# EAGLE design Snake (EAGLE 7.7.0)
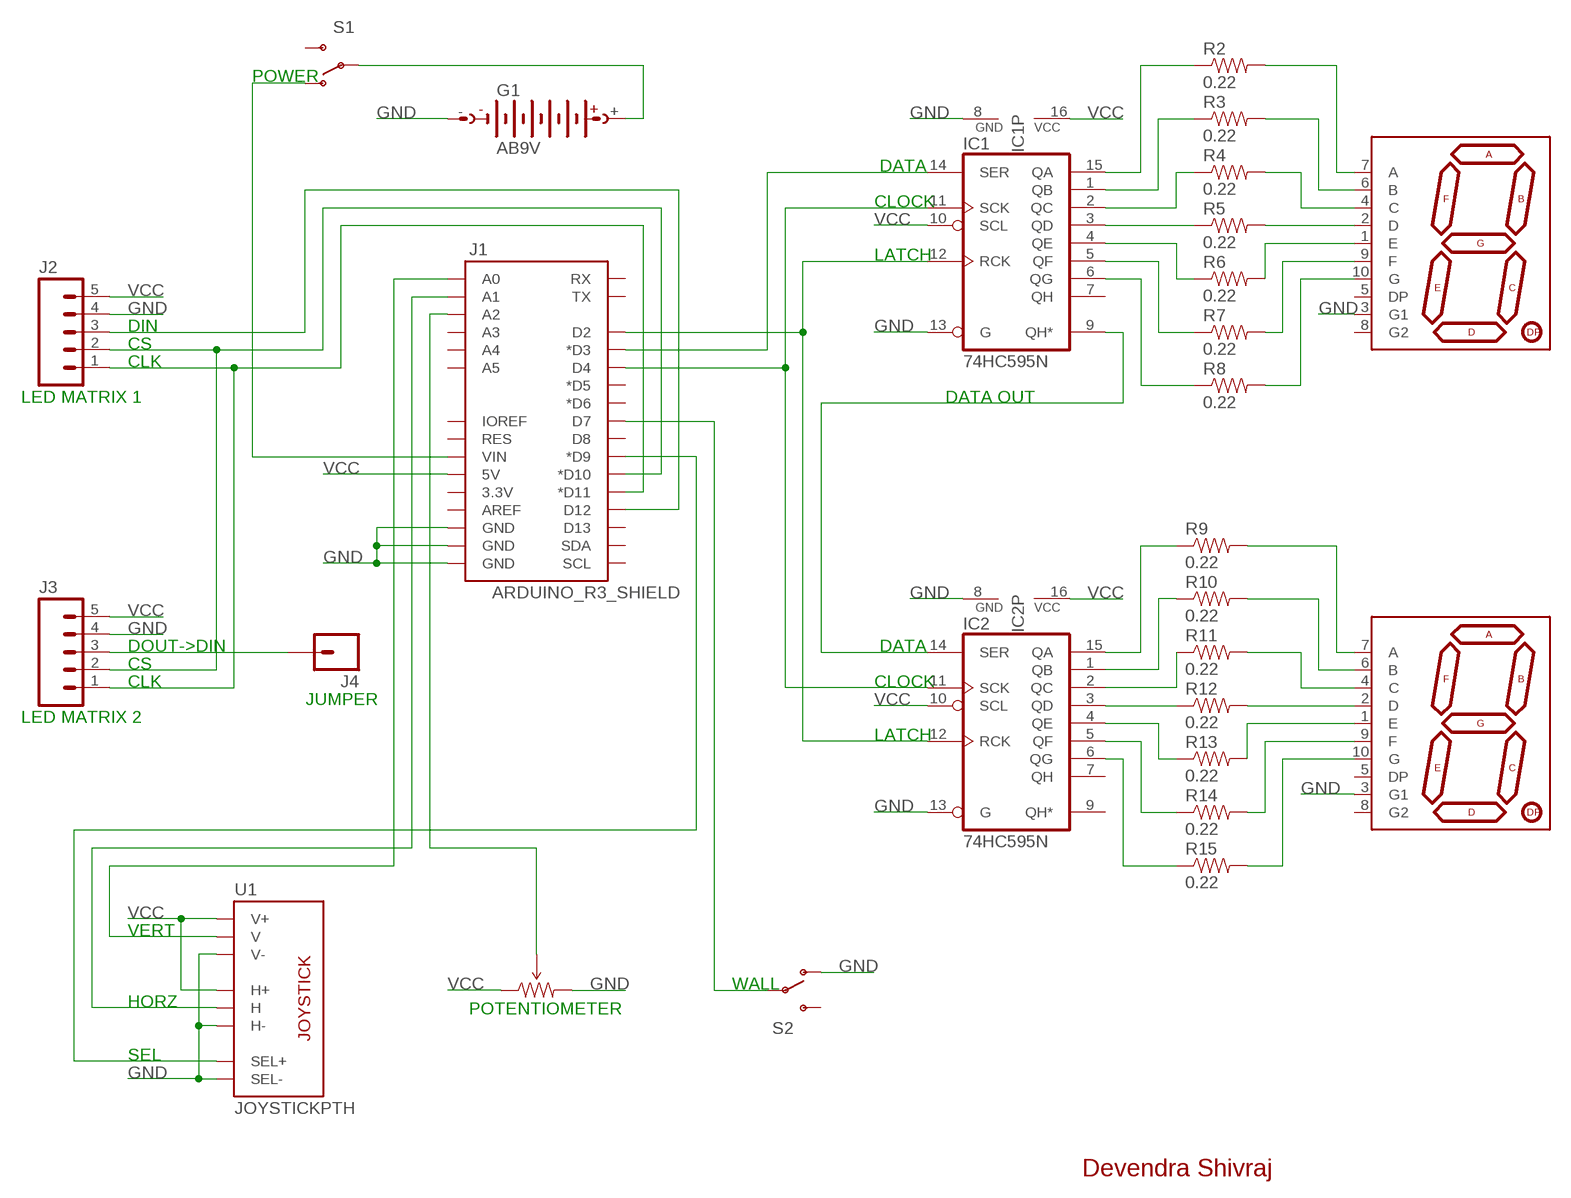
[diagram p0: schematic, sheet 1]

## Parts
G1  AB9V  [AB9V]
IC1  74HC595N  [DIL16]
IC2  74HC595N  [DIL16]
J1  ARDUINO_R3_SHIELD  [UNO_R3_SHIELD]
J2  M05PTH  [1X05]
J3  M05PTH  [1X05]
J4  M01PTH  [1X01]
R1  TSR-3386  TRIMPOT-PTH-KNOB  [3386U]
R2  0.22  0.22OHM-1/4W-1%(0805)  [0805]
R3  0.22  0.22OHM-1/4W-1%(0805)  [0805]
R4  0.22  0.22OHM-1/4W-1%(0805)  [0805]
R5  0.22  0.22OHM-1/4W-1%(0805)  [0805]
R6  0.22  0.22OHM-1/4W-1%(0805)  [0805]
R7  0.22  0.22OHM-1/4W-1%(0805)  [0805]
R8  0.22  0.22OHM-1/4W-1%(0805)  [0805]
R9  0.22  0.22OHM-1/4W-1%(0805)  [0805]
R10  0.22  0.22OHM-1/4W-1%(0805)  [0805]
R11  0.22  0.22OHM-1/4W-1%(0805)  [0805]
R12  0.22  0.22OHM-1/4W-1%(0805)  [0805]
R13  0.22  0.22OHM-1/4W-1%(0805)  [0805]
R14  0.22  0.22OHM-1/4W-1%(0805)  [0805]
R15  0.22  0.22OHM-1/4W-1%(0805)  [0805]
S1  SWITCH-SPDTPTH  [SWITCH-SPDT]
S2  SWITCH-SPDTPTH  [SWITCH-SPDT]
U1  JOYSTICKPTH  [JOYSTICK]
U$1  7-SEGMENT-DISPLAYPTH  [7-SEGMENT-DISPLAY]
U$2  7-SEGMENT-DISPLAYPTH  [7-SEGMENT-DISPLAY]

## Nets
+: G1.+ S1.2(P)
A2: J1.A2 R1.2(WIPER)
CLK: J1.D11(*D11) J2.1 J3.1
CLOCK: IC1.11(SCK) IC2.11(SCK) J1.D4
CS: J1.D10(*D10) J2.2 J3.2
DATA: IC1.14(SER) J1.D3(*D3)
DATA_SHIFT: IC1.9(QH*) IC2.14(SER)
DIN: J1.D12 J2.3
GND: G1.- IC1.8(GND) IC1.13(G) IC2.8(GND) IC2.13(G) J1.GND@0(GND) J1.GND@1(GND) J1.GND@2(GND) J2.4 J3.4 R1.3(CW) S2.1(O) U1.B2A(SEL-) U1.H3(H-) U1.V3(V-) U$1.3(G1) U$2.3(G1)
HORZ: J1.A1 U1.H2(H)
LATCH: IC1.12(RCK) IC2.12(RCK) J1.D2
N$1: J3.3 J4.1
N$3: J1.VIN S1.1(O)
N$4: IC1.15(QA) R2.1
N$5: IC1.1(QB) R3.1
N$6: IC1.2(QC) R4.1
N$7: IC1.3(QD) R5.1
N$8: IC1.4(QE) R6.1
N$9: IC1.5(QF) R7.1
N$10: IC1.6(QG) R8.1
N$15: R2.2 U$1.7(A)
N$16: R3.2 U$1.6(B)
N$17: R4.2 U$1.4(C)
N$18: R5.2 U$1.2(D)
N$19: R6.2 U$1.1(E)
N$20: R7.2 U$1.9(F)
N$21: R8.2 U$1.10(G)
N$22: IC2.15(QA) R9.1
N$23: J1.D7 S2.2(P)
N$27: IC2.1(QB) R10.1
N$28: IC2.2(QC) R11.1
N$30: IC2.3(QD) R12.1
N$31: IC2.4(QE) R13.1
N$32: IC2.5(QF) R14.1
N$33: IC2.6(QG) R15.1
N$34: R9.2 U$2.7(A)
N$35: R10.2 U$2.6(B)
N$36: R11.2 U$2.4(C)
N$37: R12.2 U$2.2(D)
N$38: R13.2 U$2.1(E)
N$39: R14.2 U$2.9(F)
N$40: R15.2 U$2.10(G)
SEL: J1.D9(*D9) U1.B1A(SEL+)
VCC: IC1.10(SCL) IC1.16(VCC) IC2.10(SCL) IC2.16(VCC) J1.5V J2.5 J3.5 R1.1(CCW) U1.H1(H+) U1.V1(V+)
VERT: J1.A0 U1.V2(V)
Unconnected: IC1.7(QH) IC2.7(QH) IC2.9(QH*) J1.3.3V J1.A3 J1.A4 J1.A5 J1.AREF J1.D5(*D5) J1.D6(*D6) J1.D8 J1.D13 J1.IOREF J1.RES J1.RX J1.SCL J1.SDA J1.TX S1.3(S) S2.3(S) U$1.5(DP) U$1.8(G2) U$2.5(DP) U$2.8(G2)

## Notes on the sheet
- POWER
- DATA
- CLOCK
- LATCH
- DIN
- CS
- CLK
- LED MATRIX 1 | DATA OUT
- DOUT->DIN | DATA
- CS
- CLK | CLOCK
- JUMPER
- LED MATRIX 2
- LATCH
- VERT
- WALL
- HORZ
- POTENTIOMETER
- SEL
- Devendra Shivraj

## Library data of the parts
G1 = battery:AB9V: 9-V BATTERY CLIP
IC1 IC2 = 74xx-eu:74*595: 8-bit SHIFT REGISTER, output latch
J1 = SparkFun-Boards:ARDUINO_R3_SHIELD: Shield form compatible with the Arduino Uno R3.
J2 J3 = SparkFun-Connectors:M05: Header 5 Standard 5-pin 0.1" header. Use with straight break away headers (SKU : PRT-00116), right angle break away headers (PRT-00553), swiss pins (PRT-00743), machine pins (PRT-00117), and female headers (PRT-00115). Molex polarized connector foot print use with SKU : PRT-08230 with associated crimp pins and housings.
J4 = SparkFun-Connectors:M01: Header 1 Standard 1-pin 0.1" header. Use with straight break away headers (SKU : PRT-00116), right angle break away headers (PRT-00553), swiss pins (PRT-00743), machine pins (PRT-00117), and female headers (PRT-00115). SMTSO-256-ET is a "flush mount" nut for a 4-40 screw. The older package used to be too tight, and did not allow it to sit properly thru the drill hit. The latest (0.165DIA) fits nice and snug.
R1 = SparkFun-Electromechanical:TRIMPOT: Various small potentiometers for "set-and-forget" applications; PROD_ID: RES-09730
R2-R15 = SparkFun-Resistors:0.22OHM-1/4W-1%(0805): RES-09883; PROD_ID: RES-09883
S1 S2 = SparkFun-Electromechanical:SWITCH-SPDT: SPDT Switch Simple slide switch, Spark Fun Electronics SKU : COM-00102 DPDT SMT slide switch, AYZ0202, SWCH-08179; PROD_ID: SWCH-08261
U1 = SparkFun:JOYSTICK: Thumb Joystick Joystick commonly found in PS2 controllers. Two pots and a select switch. Footprint proven. Spark Fun Electronics SKU : COM-09032
U$1 U$2 = SparkFun-Displays:7-SEGMENT-DISPLAY

## Board
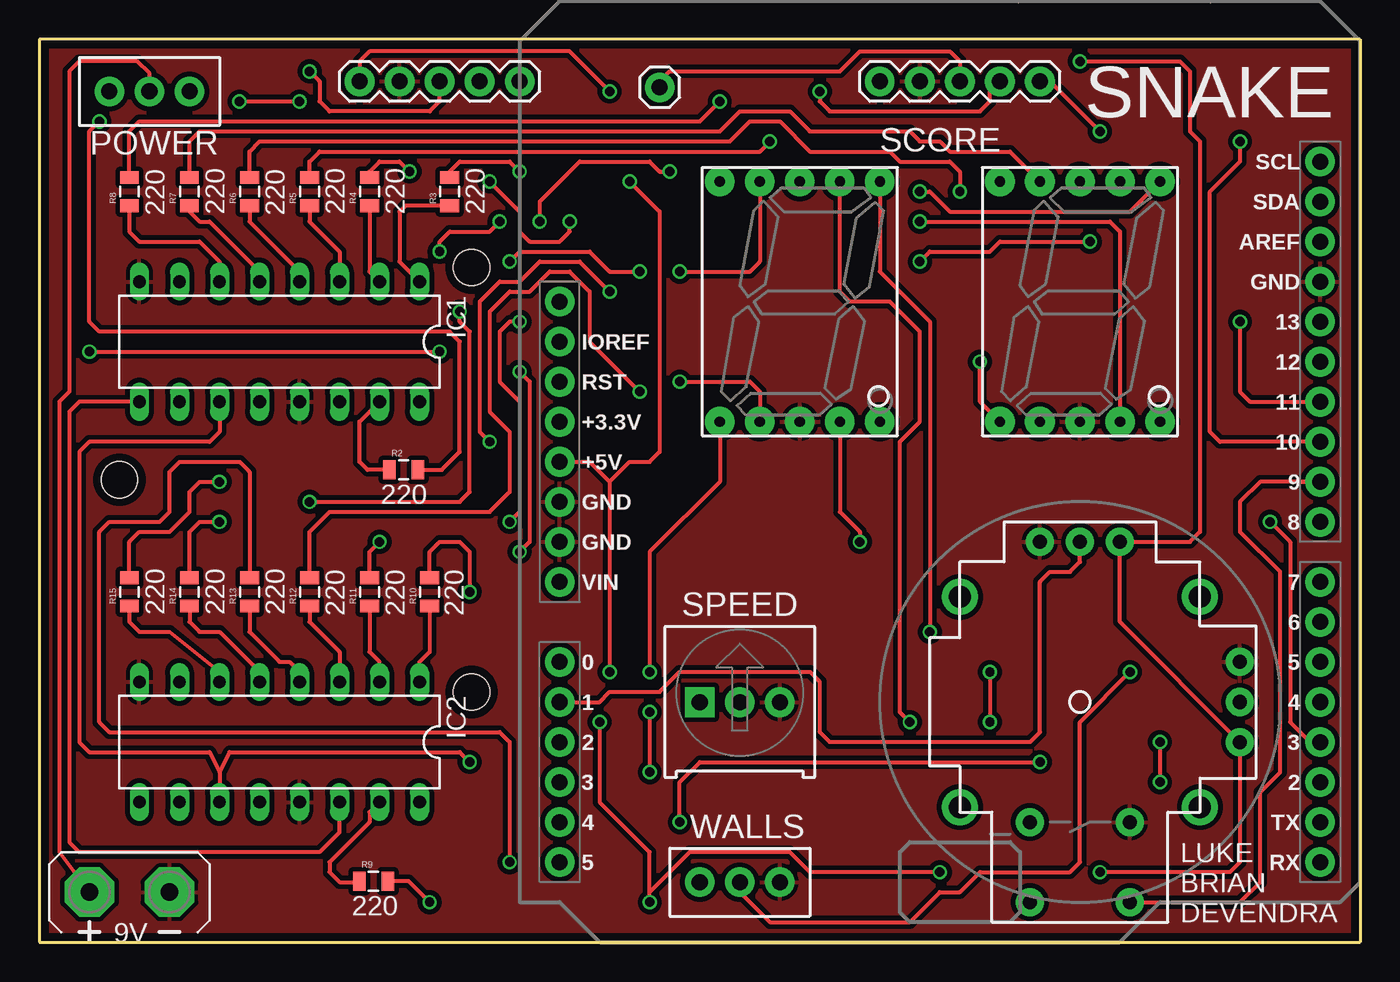
[diagram p1: board, top side]
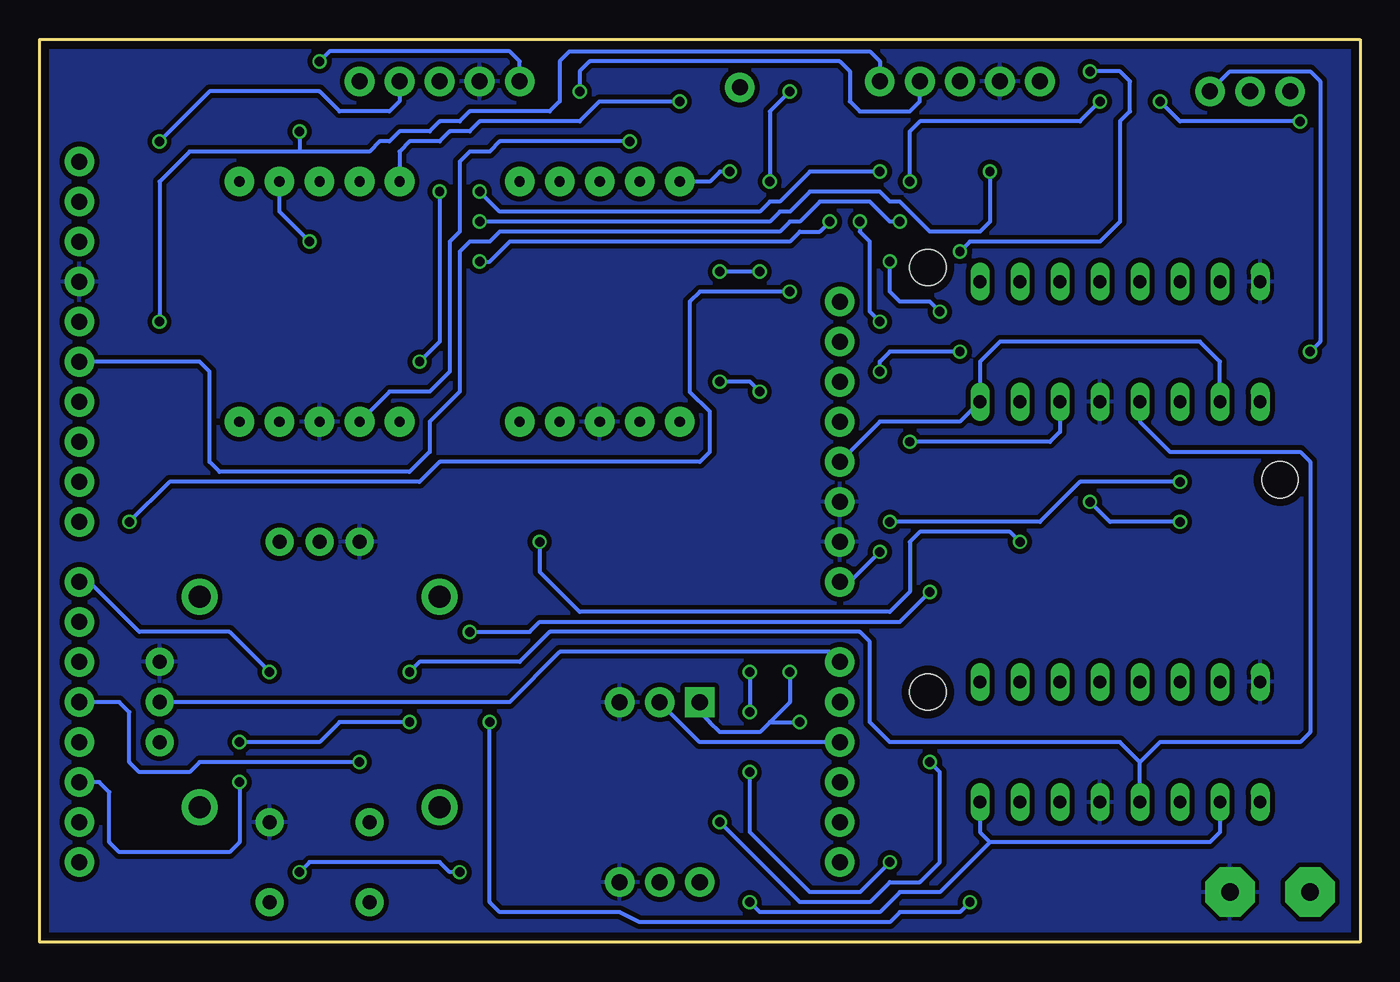
[diagram p2: board, bottom side, seen from below]

Size 83.82 x 57.28 mm. Coordinates in mm from the lower left corner, seen from the top.
Outline: 0,0 83.82,0 83.82,57.28 0,57.28 0,0
Copper layers (1*16): Top 0.035mm / dielectric 1.6mm / Bottom 0.035mm
Design rules "Elecrow_2-layer_PCB_eagle_rule": minimum track width 6mil, minimum drill 12mil, track to track 6mil, track to pad 6mil, pad to pad 6mil, via to via 8mil, smd to smd 0mil, copper to edge 20mil, drill to drill 10mil, minimum pad ring 6mil, minimum via ring 6mil, stop-mask expansion 0mil, vias tented up to drill 100mil, thermal gap 10mil
Holes 2.29 mm at 5.08,29.34 27.43,42.8 27.43,15.88

### Footprints (pad centres in the part's own frame; a part is rotated, then mirrored left to right if it is on the bottom)
AB9V = drill 1.118 pad 3.15 octagon: + 0,2.54; - 0,-2.54
DIL16 = drill 0.813 long: 1 -8.89,-3.81; 2 -6.35,-3.81; 3 -3.81,-3.81; 4 -1.27,-3.81; 5 1.27,-3.81; 6 3.81,-3.81; 7 6.35,-3.81; 8 8.89,-3.81; 9 8.89,3.81; 10 6.35,3.81; 11 3.81,3.81; 12 1.27,3.81; 13 -1.27,3.81; 14 -3.81,3.81; 15 -6.35,3.81; 16 -8.89,3.81
UNO_R3_SHIELD = drill 1.016 pad 1.88: 3.3V 50.8,26.67; 5V 50.8,29.21; A0 50.8,41.91; A1 50.8,44.45; A2 50.8,46.99; A3 50.8,49.53; A4 50.8,52.07; A5 50.8,54.61; AREF 2.54,15.24; D2 2.54,49.53; D3 2.54,46.99; D4 2.54,44.45; D5 2.54,41.91; D6 2.54,39.37; D7 2.54,36.83; D8 2.54,33.02; D9 2.54,30.48; D10 2.54,27.94; D11 2.54,25.4; D12 2.54,22.86; D13 2.54,20.32; GND@0 50.8,31.75; GND@1 50.8,34.29; GND@2 2.54,17.78; IOREF 50.8,21.59; NC 50.8,19.05; RES 50.8,24.13; RX 2.54,54.61; SCL 2.54,10.16; SDA 2.54,12.7; TX 2.54,52.07; VIN 50.8,36.83
1X05 = drill 1.016 pad 1.88: 1 0,0; 2 2.54,0; 3 5.08,0; 4 7.62,0; 5 10.16,0
1X01 = drill 1.016 pad 1.88: 1 0,0
3386U = drill 1.016 pad 1.88 square: 1 -2.54,-0.015 | drill 1.016 pad 1.88: 2 0,-0.015; 3 2.54,-0.015
0805 = smd 0.8 x 1.2: 1 -0.9,0; 2 0.9,0
SWITCH-SPDT = drill 1.016 pad 1.88: 1 0,2.54; 2 0,0; 3 0,-2.54
JOYSTICK = drill 0.9 pad 1.778: B1A -3.175,12.7; B1B 3.175,12.7; B2A -3.175,7.62; B2B 3.175,7.62 | drill 0.889 pad 1.778: H1 -2.54,-10.16; H2 0,-10.16; H3 2.54,-10.16; V1 -10.16,2.54; V2 -10.16,0; V3 -10.16,-2.54 | drill 1.397 pad 2.286: MOUNT1 -7.62,6.668; MOUNT2 -7.62,-6.668; MOUNT3 7.62,-6.668; MOUNT4 7.62,6.668
7-SEGMENT-DISPLAY = drill 0.65 pad 1.88: 1 -5.08,-7.62; 2 -2.54,-7.62; 3 0,-7.62; 4 2.54,-7.62; 5 5.08,-7.62; 6 5.08,7.62; 7 2.54,7.62; 8 0,7.62; 9 -2.54,7.62; 10 -5.08,7.62

### Placement (x,y rotation side)
G1  5.71,3.17 90 top
IC1  15.24,38.1 180 top
IC2  15.24,12.7 180 top
J1  83.82,59.69 180 top
J2  30.48,54.61 180 top
J3  63.5,54.61 180 top
J4  39.37,54.23 0 top
R1  44.45,15.24 0 top
R2  23.11,29.97 0 top
R3  26.04,47.62 90 top
R4  20.95,47.62 90 top
R5  17.14,47.62 90 top
R6  13.34,47.62 90 top
R7  9.53,47.62 90 top
R8  5.71,47.62 90 top
R9  21.21,3.87 0 top
R10  24.77,22.23 90 top
R11  20.95,22.23 90 top
R12  17.14,22.23 90 top
R13  13.34,22.23 90 top
R14  9.53,22.23 90 top
R15  5.71,22.23 90 top
S1  6.99,53.98 270 top
S2  44.45,3.81 270 top
U1  66.04,15.24 180 top
U$1  66.04,40.64 0 top
U$2  48.26,40.64 0 top

### Tracks (layer width: path | path; a pad name or v marks a point on that pad's centre or on a via)
+
  Top 0.254: S1.2 6.99,55.12 6.22,55.88 2.54,55.88 1.91,55.24 1.91,34.92 1.27,34.29 1.27,5.71 G1.+
A2
  Bottom 0.254: J1.A2 41.92,12.7 R1.2
CLK  (via drill 0.6)
  Top 0.254: J1.D11 76.83,34.29 76.2,34.92 v76.2,39.37 | J3.1 64.14,54.61 v67.31,51.44
  Bottom 0.254: 67.31,50.16 62.87,50.16 62.23,50.8 61.59,50.8 60.96,51.44 59.05,51.44 58.42,52.07 57.15,52.07 56.52,52.7 51.44,52.7 50.8,53.34 50.8,55.88 50.16,56.52 31.11,56.52 30.48,55.88 J2.1 | 67.31,50.16 74.3,50.16 76.2,48.26 v76.2,39.37 | v67.31,51.44 67.31,50.16
CLOCK  (via drill 0.6)
  Top 0.254: IC1.11 11.43,32.38 10.79,31.75 3.17,31.75 2.54,31.11 2.54,12.7 3.17,12.06 10.79,12.06 11.43,10.79 | 11.43,10.79 IC2.11 | 11.43,10.79 12.06,12.06 26.67,12.06 v27.3,11.43 | v40.64,7.62 40.64,10.16 41.91,11.43 v63.5,11.43
  Bottom 0.254: v27.3,11.43 26.67,10.79 26.67,5.08 27.94,3.81 29.84,3.81 31.11,2.54 35.56,2.54 v40.64,7.62 | v63.5,11.43 73.66,11.43 74.3,10.79 77.47,10.79 78.11,11.43 78.11,14.61 78.74,15.24 J1.D4
CS  (via drill 0.6)
  Top 0.254: J1.D10 74.93,31.75 74.3,32.38 74.3,47.62 76.2,49.53 v76.2,50.8 | J3.2 60.33,53.98 60.33,53.34 59.69,52.7 50.16,52.7 49.53,53.34 v49.53,53.98
  Bottom 0.254: J2.2 27.94,53.34 28.57,52.7 31.75,52.7 32.38,53.34 32.38,55.24 33.02,55.88 48.9,55.88 49.53,55.24 v49.53,53.98 | J3.2 60.96,53.34 61.59,52.7 64.77,52.7 66.04,53.98 73.03,53.98 v76.2,50.8
DATA  (via drill 0.6)
  Top 0.254: v36.2,41.27 34.29,43.18 31.75,43.18 30.48,41.91 29.21,41.91 27.94,40.64 27.94,32.38 v28.57,31.75 | J1.D3 80.64,12.7 79.38,13.97 79.38,25.4 v78.11,26.67
  Bottom 0.254: v36.2,41.27 41.91,41.27 42.55,40.64 42.55,34.92 41.27,33.66 41.27,31.11 41.91,30.48 58.42,30.48 59.69,29.21 75.56,29.21 v78.11,26.67 | IC1.14 19.05,32.38 19.68,31.75 v28.57,31.75
DATA_SHIFT
  Top 0.254: IC1.9 2.54,34.29 1.91,33.66 1.91,6.35 2.54,5.71 17.78,5.71 19.05,6.99 IC2.14
DIN  (via drill 0.6)
  Top 0.254: v17.14,55.24 17.78,54.61 17.78,53.34 18.41,52.7 24.77,52.7 25.4,53.34 J2.3 | v25.4,43.81 25.4,44.45 26.04,45.09 28.57,45.09 v29.21,45.72
  Bottom 0.254: J1.D12 73.66,36.83 73.03,36.2 73.03,30.48 72.39,29.84 60.33,29.84 59.05,31.11 59.05,33.02 57.15,34.92 57.15,43.81 56.52,44.45 55.24,44.45 54.61,45.09 36.83,45.09 36.2,45.72 35.56,45.72 34.29,46.99 31.11,46.99 29.84,45.72 v29.21,45.72 | v17.14,55.24 15.24,55.24 14.61,54.61 14.61,52.7 15.24,52.07 15.24,45.72 16.51,44.45 24.77,44.45 v25.4,43.81
GND
  pour Top (isolate 0.305): 0,0 0,57.28 83.82,57.28 83.82,57.15 83.82,0
  pour Bottom (isolate 0.305): 0,0 0,57.28 83.82,57.28 83.82,57.15 83.82,0
HORZ
  Top 0.254: J1.A1 35.56,15.24 36.2,15.88 39.37,15.88 40.64,17.14 48.9,17.14 49.53,16.51 49.53,13.34 50.16,12.7 62.87,12.7 63.5,13.34 63.5,22.86 64.14,23.5 65.41,23.5 66.04,24.13 U1.H2
LATCH  (via drill 0.6)
  Top 0.254: v60.33,17.14 v60.33,13.97 | v71.12,12.7 v71.12,10.16
  Bottom 0.254: IC1.12 13.97,33.02 12.06,31.11 3.81,31.11 3.17,30.48 3.17,13.34 3.81,12.7 12.7,12.7 13.97,11.43 | IC2.12 13.97,11.43 | 13.97,11.43 15.24,12.7 29.84,12.7 31.11,13.97 31.11,19.05 31.75,19.68 51.44,19.68 53.34,17.78 59.69,17.78 v60.33,17.14 | v60.33,13.97 64.77,13.97 66.04,12.7 v71.12,12.7 | v71.12,10.16 71.12,6.35 71.75,5.71 78.74,5.71 79.38,6.35 79.38,9.53 80.01,10.16 J1.D2
N$1
  Top 0.254: J4.1 39.37,54.61 40.01,55.24 50.8,55.24 52.07,56.52 57.78,56.52 58.42,55.88 J3.3
N$3  (via drill 0.6)
  Top 0.254: v30.48,24.77 31.11,25.4 31.11,35.56 v30.48,36.2 | v3.17,37.47 v25.4,37.47
  Bottom 0.254: v25.4,37.47 29.84,37.47 30.48,36.83 v30.48,36.2 | S1.1 8.26,55.24 3.17,55.24 2.54,54.61 2.54,38.1 v3.17,37.47 | v30.48,24.77 32.38,22.86 J1.VIN
N$4
  Top 0.254: R2.1 20.83,29.97 20.32,30.48 20.32,33.02 IC1.15
N$5
  Top 0.254: R3.1 23.23,46.73 22.86,46.35 22.86,43.18 IC1.1
N$6
  Top 0.254: IC1.2 20.95,42.55 R4.1
N$7
  Top 0.254: IC1.3 19.05,43.81 17.14,45.72 R5.1
N$8
  Top 0.254: R6.1 13.34,45.72 16.51,42.55 IC1.4
N$9
  Top 0.254: IC1.5 13.97,42.55 10.79,45.72 10.16,45.72 9.53,46.35 R7.1
N$10
  Top 0.254: R8.1 5.71,45.09 6.35,44.45 10.16,44.45 11.43,43.18 IC1.6
N$15  (via drill 0.6)
  Top 0.254: R2.2 25.53,29.97 26.67,31.11 26.67,38.1 26.04,38.73 3.81,38.73 3.17,39.37 3.17,51.44 v3.81,52.07 | v66.67,44.45 60.96,44.45 60.33,43.81 56.52,43.81 v55.88,43.18 | v33.66,45.72 33.66,45.09 33.02,44.45 31.11,44.45 30.48,45.09 30.48,46.35 v28.57,48.26 | v12.7,53.34 v16.51,53.34
  Bottom 0.254: v66.67,44.45 68.58,46.35 U$1.7 | v33.66,45.72 34.29,45.09 35.56,45.09 36.2,44.45 53.98,44.45 55.24,43.18 v55.88,43.18 | v12.7,53.34 11.43,52.07 v3.81,52.07 | v16.51,53.34 17.78,52.07 27.94,52.07 28.57,51.44 v28.57,48.26
N$16  (via drill 0.6)
  Top 0.254: U$1.6 69.22,46.35 57.78,46.35 56.52,47.62 v55.88,47.62 | R3.2 26.04,48.9 26.67,49.53 29.84,49.53 v30.48,48.9
  Bottom 0.254: v30.48,48.9 34.92,48.9 36.83,46.99 37.47,46.99 38.1,46.35 54.61,46.35 v55.88,47.62
N$17  (via drill 0.6)
  Top 0.254: v55.88,45.72 67.94,45.72 68.58,45.09 U$1.4 | v23.5,48.9 22.86,49.53 21.59,49.53 20.95,48.9 R4.2
  Bottom 0.254: v55.88,45.72 37.47,45.72 36.83,46.35 36.2,46.35 34.92,47.62 30.48,47.62 29.84,46.99 29.21,46.99 27.3,45.09 24.13,45.09 23.5,45.72 v23.5,48.9
N$18  (via drill 0.6)
  Top 0.254: R5.2 17.14,49.53 17.78,50.16 45.72,50.16 v46.35,50.8
  Bottom 0.254: U$1.2 61.59,34.92 59.05,34.92 57.78,36.2 57.78,44.45 57.15,45.09 57.15,49.53 56.52,50.16 55.24,50.16 54.61,50.8 v46.35,50.8
N$19  (via drill 0.6)
  Top 0.254: R6.2 13.34,50.16 13.97,50.8 43.81,50.8 45.09,52.07 46.99,52.07 48.9,50.16 53.98,50.16 54.61,49.53 57.78,49.53 58.42,48.9 v58.42,47.62 | U$1.1 59.69,34.29 v59.69,36.83
  Bottom 0.254: v58.42,47.62 58.42,38.1 v59.69,36.83
N$20
  Top 0.254: R7.2 9.53,50.8 10.16,51.44 43.18,51.44 44.45,52.7 47.62,52.7 48.9,51.44 55.24,51.44 55.88,50.8 57.15,50.8 57.78,50.16 61.59,50.16 U$1.9
N$21  (via drill 0.6)
  Top 0.254: R8.2 5.71,51.44 6.35,52.07 41.91,52.07 v43.18,53.34
  Bottom 0.254: U$1.10 60.96,50.16 60.33,50.8 58.42,50.8 57.78,51.44 56.52,51.44 55.88,52.07 49.53,52.07 48.26,53.34 v43.18,53.34
N$22
  Top 0.254: 20.32,3.88 R9.1 20.25,3.81 19.05,3.81 18.41,4.45 18.41,5.08 20.95,7.62 20.95,8.26 IC2.15
N$23  (via drill 0.6)
  Top 0.254: v69.22,17.14 66.04,13.97 66.04,5.08 65.41,4.45 59.69,4.45 58.42,3.17 57.15,3.17 55.24,1.27 46.35,1.27 44.45,3.17 S2.2
  Bottom 0.254: J1.D7 80.64,22.86 77.47,19.68 71.75,19.68 v69.22,17.14
N$27
  Top 0.254: IC2.1 24.13,17.78 24.77,18.41 R10.1
N$28
  Top 0.254: IC2.2 21.59,17.78 20.95,18.41 R11.1
N$30
  Top 0.254: IC2.3 19.05,18.41 17.14,20.32 R12.1
N$31
  Top 0.254: IC2.4 16.51,17.14 15.88,17.78 15.24,17.78 13.34,19.68 R13.1
N$32
  Top 0.254: IC2.5 13.97,17.14 11.43,19.68 10.16,19.68 9.53,20.32 R14.1
N$33
  Top 0.254: IC2.6 11.43,17.14 8.26,19.68 6.35,19.68 5.71,20.32 R15.1
N$34  (via drill 0.6)
  Top 0.254: U$2.7 50.8,41.27 51.44,40.64 53.98,40.64 55.88,38.73 55.88,33.02 54.61,31.75 54.61,14.61 v55.24,13.97 | R9.2 23.43,3.87 v24.77,2.54
  Bottom 0.254: v24.77,2.54 25.4,1.91 29.21,1.91 29.84,1.27 45.72,1.27 46.99,1.91 54.61,1.91 55.24,2.54 v55.24,13.97
N$35  (via drill 0.6)
  Top 0.254: U$2.6 53.34,42.55 56.52,39.37 v56.52,19.68 | R10.2 24.77,24.77 25.4,25.4 26.67,25.4 27.3,24.77 v27.3,22.23
  Bottom 0.254: v56.52,19.68 52.7,19.68 52.07,20.32 29.21,20.32 v27.3,22.23
N$36  (via drill 0.6)
  Top 0.254: U$2.4 50.8,27.3 52.07,26.04 v52.07,25.4 | R11.2 20.95,24.77 v21.59,25.4
  Bottom 0.254: v52.07,25.4 52.07,23.5 49.53,20.95 29.84,20.95 28.57,22.23 28.57,25.4 27.94,26.04 22.23,26.04 v21.59,25.4
N$37  (via drill 0.6)
  Top 0.254: v38.1,34.92 34.92,38.1 34.92,41.27 33.66,42.55 32.38,42.55 31.11,41.27 29.84,41.27 28.57,40.01 28.57,33.66 29.84,32.38 29.84,28.57 28.57,27.3 18.41,27.3 17.14,26.04 R12.2 | v40.64,35.56 45.09,35.56 45.72,34.92 U$2.2
  Bottom 0.254: v38.1,34.92 38.73,35.56 v40.64,35.56
N$38  (via drill 0.6)
  Top 0.254: R13.2 13.34,29.84 12.7,30.48 8.89,30.48 8.26,29.84 8.26,27.3 7.62,26.67 4.45,26.67 3.81,26.04 3.81,13.97 4.45,13.34 29.21,13.34 29.84,12.7 v29.84,5.08 | U$2.1 43.18,29.21 38.73,24.77 v38.73,17.14 | v38.73,14.61 v38.73,10.79
  Bottom 0.254: v29.84,5.08 31.75,3.17 34.92,3.17 38.73,6.99 v38.73,10.79 | v38.73,17.14 v38.73,14.61
N$39  (via drill 0.6)
  Top 0.254: U$2.9 45.72,43.18 45.09,42.55 v40.64,42.55 | v17.14,27.94 26.67,27.94 27.3,28.57 27.3,38.73 26.67,39.37 v26.67,40.01 | v38.1,42.55 36.2,42.55 34.92,43.81 30.48,43.81 v29.84,43.18 | R14.2 9.53,26.04 10.16,26.67 v11.43,26.67
  Bottom 0.254: v38.1,42.55 v40.64,42.55 | v11.43,26.67 15.88,26.67 v17.14,27.94 | v26.67,40.01 27.3,40.64 29.21,40.64 29.84,41.27 v29.84,43.18
N$40  (via drill 0.6)
  Top 0.254: v29.84,26.67 30.48,27.3 30.48,34.29 29.21,35.56 29.21,38.73 29.84,39.37 v30.48,39.37 | v31.75,45.72 31.75,46.99 34.29,49.53 38.73,49.53 39.37,48.9 v40.01,48.9 | R15.2 5.71,25.4 6.35,26.04 8.26,26.04 9.53,27.3 9.53,28.57 10.16,29.21 v11.43,29.21
  Bottom 0.254: v29.84,26.67 20.32,26.67 17.78,29.21 v11.43,29.21 | U$2.10 41.27,48.26 40.64,48.9 v40.01,48.9 | v30.48,39.37 31.11,40.01 31.11,44.45 31.75,45.09 v31.75,45.72
SEL
  Top 0.254: 80.01,29.21 J1.D9 77.47,29.21 76.2,27.94 76.2,26.04 78.74,23.5 78.74,10.79 77.47,9.53 77.47,3.81 76.2,2.54 U1.B1A
VCC  (via drill 0.6)
  Top 0.254: 38.73,3.17 38.73,5.71 35.56,8.89 v35.56,13.97 | v57.15,4.45 48.9,4.45 47.62,5.71 41.27,5.71 38.73,3.17 | J1.5V 34.92,30.48 36.2,29.21 | 36.2,29.21 37.47,30.48 38.73,30.48 39.37,31.11 39.37,46.35 v37.47,48.26 | v67.31,4.45 75.56,4.45 76.2,5.08 U1.V1 68.58,20.32 U1.H1 73.03,25.4 73.66,26.04 73.66,50.8 73.03,51.44 73.03,55.24 72.39,55.88 v66.04,55.88 | v38.73,2.54 38.73,3.17 | 36.2,29.21 v36.2,17.14 | v36.2,53.98 33.66,56.52 20.95,56.52 20.32,55.88 J2.5
  Bottom 0.254: IC1.10 8.89,36.83 10.16,38.1 22.86,38.1 24.13,36.83 IC1.16 25.4,33.02 30.48,33.02 J1.5V | IC2.10 8.89,6.99 9.53,6.35 23.5,6.35 | IC2.16 24.13,6.99 23.5,6.35 | 23.5,6.35 26.67,3.17 29.21,3.17 30.48,1.91 38.1,1.91 v38.73,2.54 | 37.47,13.97 36.2,15.24 v36.2,17.14 | 37.47,13.97 38.1,13.34 40.64,13.34 41.29,13.96 41.29,13.98 41.91,14.61 R1.1 | v57.15,4.45 57.78,4.45 58.42,5.08 66.67,5.08 v67.31,4.45 | v37.47,48.26 37.47,52.7 v36.2,53.98 | 37.47,13.97 v35.56,13.97 | J3.5 53.34,55.88 53.98,56.52 65.41,56.52 v66.04,55.88
VERT
  Bottom 0.254: J1.A0 33.66,18.41 50.8,18.41 53.98,15.24 U1.V2

### Text on the board
tPlace: SNAKE | POWER | SCORE | 220 | 220 | 220 | 220 | 220 | 220 | 220 | 220 | 220 | 220 | 220 | 220 | 220 | SPEED | WALLS | LUKE | BRIAN | 220 | DEVENDRA